# Altium schematic sheet Power - MGT1V2.SchDoc
size A4
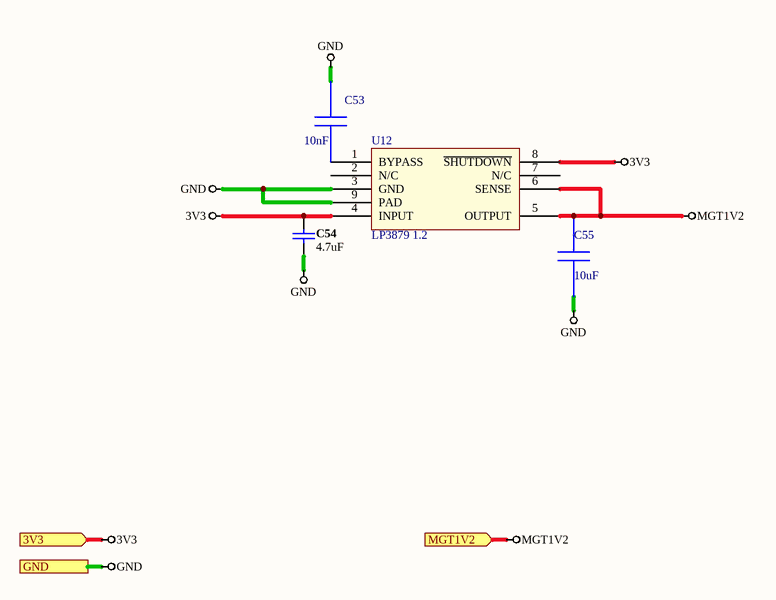
[diagram p0: Power - MGT1V2.SchDoc]

## Parts
C53  value 10nF  [CAPC0402(1005)60_L]  (hidden comment: GRM155R71E103KA01D)
C54  value 4.7uF  [CAPC0603(1608)55_L]  (hidden comment: CAP 4.7uF 10V 0603(1608))
C55  value 10uF  [1206]  (hidden comment: GRM31CR61E106KA12L)
U12  LP3879 1.2  [MRA08A]

## Ports
3V3, GND, MGT1V2

## Nets
3V3: C54.2 U12.4(INPUT) U12.8(~{SHUTDOWN}) ; port 3V3
GND: C53.1 C54.1 C55.2 U12.3(GND) U12.9(PAD) ; port GND
MGT1V2: C55.1 U12.5(OUTPUT) U12.6(SENSE) ; port MGT1V2
NetC53_2: C53.2 U12.1(BYPASS)

Not connected (* = marked no-connect by the designer): U12 2(N/C) 7(N/C)

## Library data of the parts
C53 = GRM155R71E103KA01D: GRM155R71E103KA0; Manufacturer Name: MuRata; PackageReference: GRM155R71E103KA01D; Manufacturer Part Number: GRM155R71E103KA01D
C54 = CAP 4.7uF 10V ±10% 0603 (1608 Metric) Thickness 0.55mm SMD: Manufacturer_PN: CC0603KRX5R6BB475; Case-Metric: 1608; Case-EIA: 0603; Tolerance: ±10%; Rated Voltage: 10 V; Technology: SMT; Max Thickness: 0.55 mm; Manufacturer Part Number: CC0603KRX5R6BB475
C55 = GRM31CR61E106KA12L: GRM31CR61E106KA1; Manufacturer Name: MuRata; PackageReference: GRM31CR61E106KA12L; Manufacturer Part Number: GRM31CR61E106KA12L
U12 = LP3879